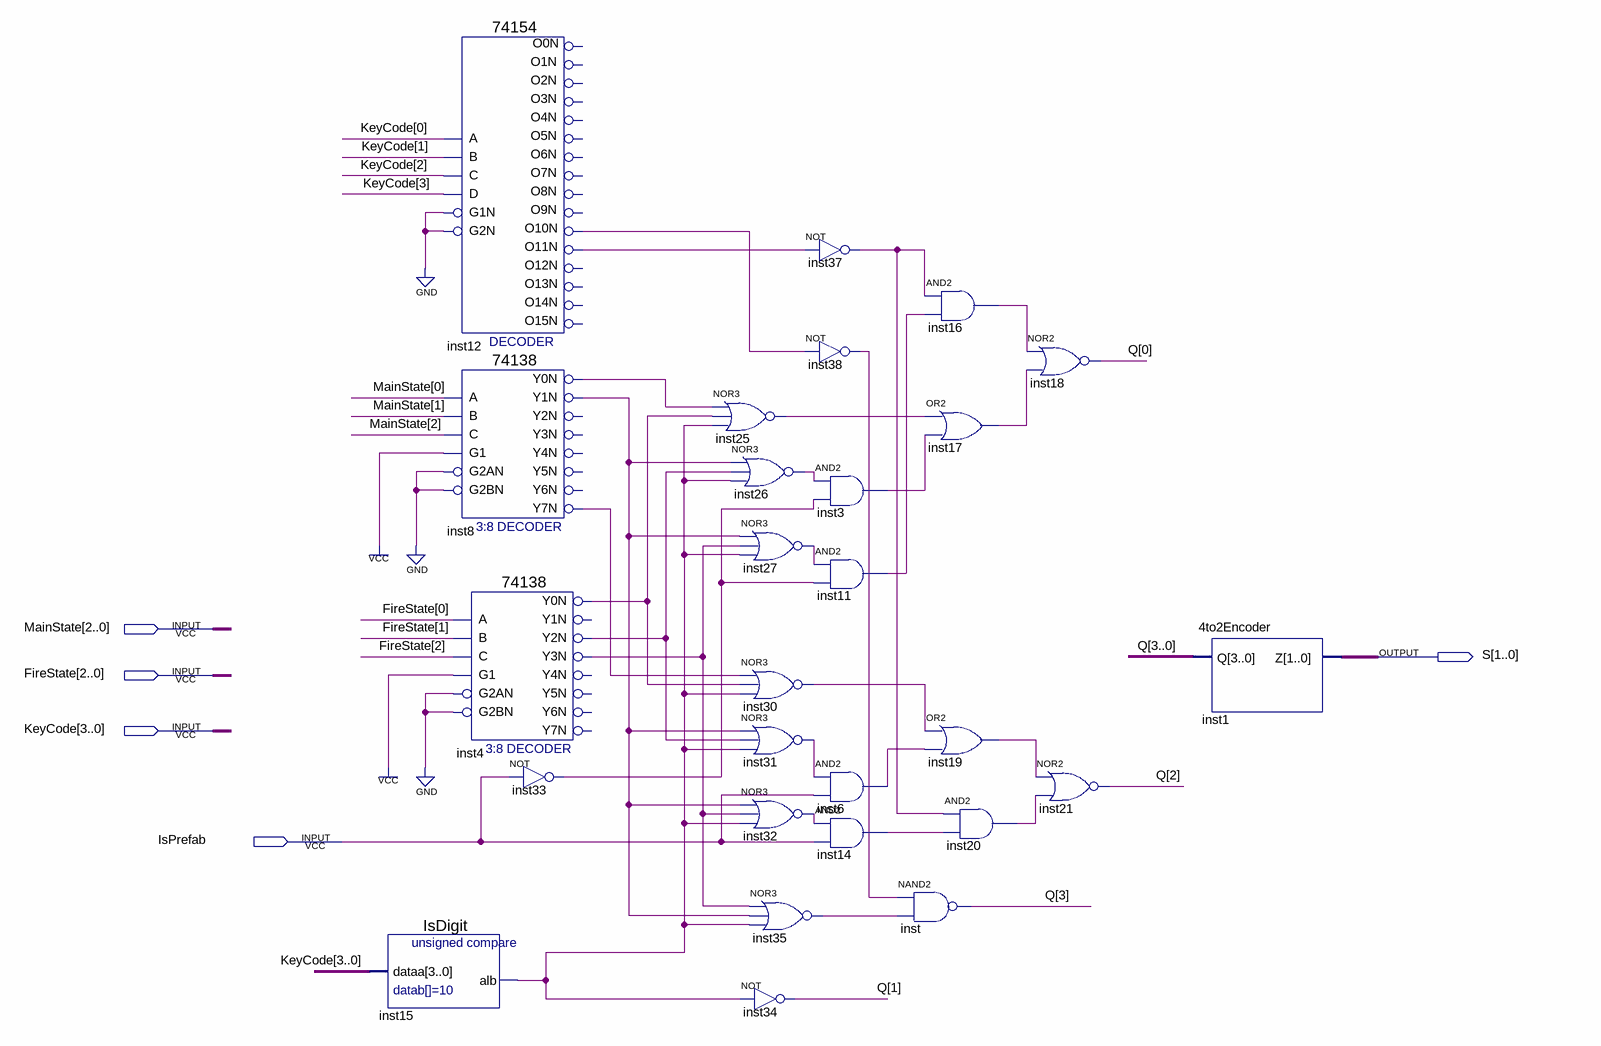
[diagram p0: schematic sheet]
// Quartus schematic FireSourceSelector.bdf as structural Verilog: 27 symbols, 5 pins
module FireSourceSelector (
  input  [2:0] MainState,
  input  [2:0] FireState,
  input  [3:0] KeyCode,
  input  IsPrefab,
  output [1:0] S
);

  wire inst3_out, inst4_y0n, inst4_y2n, inst4_y3n, inst6_out, inst8_y0n, inst8_y1n, inst8_y7n, inst11_out,
       inst12_o10n, inst12_o11n, inst14_out, inst15_alb, inst16_out, inst17_out, inst19_out, inst20_out,
       inst25_out, inst26_out, inst27_out, inst30_out, inst31_out, inst32_out, inst33_out, inst35_out,
       inst37_out, inst38_out;
  wire [3:0] Q;

  IsDigit inst15 (.dataa(KeyCode), .alb(inst15_alb));
  \74154  inst12 (
    .C(KeyCode[2]), .D(KeyCode[3]), .B(KeyCode[1]), .A(KeyCode[0]), .G1N(1'b0), .G2N(1'b0),
    .O10N(inst12_o10n), .O11N(inst12_o11n));  // open: O0N, O12N, O15N, O1N, O13N, O14N, O4N, O3N, O2N, O7N, O6N, O5N, O9N, O8N
  \74138  inst8 (
    .A(MainState[0]), .B(MainState[1]), .G1(1'b1), .C(MainState[2]), .G2AN(1'b0), .G2BN(1'b0),
    .Y0N(inst8_y0n), .Y1N(inst8_y1n), .Y7N(inst8_y7n));  // open: Y2N, Y3N, Y4N, Y5N, Y6N
  \74138  inst4 (
    .A(FireState[0]), .B(FireState[1]), .G1(1'b1), .C(FireState[2]), .G2AN(1'b0), .G2BN(1'b0),
    .Y0N(inst4_y0n), .Y2N(inst4_y2n), .Y3N(inst4_y3n));  // open: Y1N, Y4N, Y5N, Y6N, Y7N
  not inst33 (inst33_out, IsPrefab);
  nor inst25 (inst25_out, inst8_y0n, inst4_y0n, inst15_alb);
  nor inst26 (inst26_out, inst8_y1n, inst4_y2n, inst15_alb);
  nor inst27 (inst27_out, inst8_y1n, inst4_y3n, inst15_alb);
  nor inst30 (inst30_out, inst8_y7n, inst4_y0n, inst15_alb);
  nor inst31 (inst31_out, inst8_y1n, inst4_y2n, inst15_alb);
  nor inst32 (inst32_out, inst8_y1n, inst4_y3n, inst15_alb);
  nor inst35 (inst35_out, inst4_y3n, inst8_y1n, inst15_alb);
  not inst34 (Q[1], inst15_alb);
  not inst37 (inst37_out, inst12_o11n);
  not inst38 (inst38_out, inst12_o10n);
  and inst3 (inst3_out, inst26_out, inst33_out);
  and inst11 (inst11_out, inst27_out, inst33_out);
  and inst6 (inst6_out, inst31_out, IsPrefab);
  and inst14 (inst14_out, inst32_out, IsPrefab);
  nand inst (Q[3], inst38_out, inst35_out);
  and inst16 (inst16_out, inst37_out, inst11_out);
  or inst17 (inst17_out, inst25_out, inst3_out);
  or inst19 (inst19_out, inst30_out, inst6_out);
  and inst20 (inst20_out, inst37_out, inst14_out);
  nor inst18 (Q[0], inst16_out, inst17_out);
  nor inst21 (Q[2], inst19_out, inst20_out);
  \4to2Encoder  inst1 (.Q(Q), .Z(S));
endmodule
